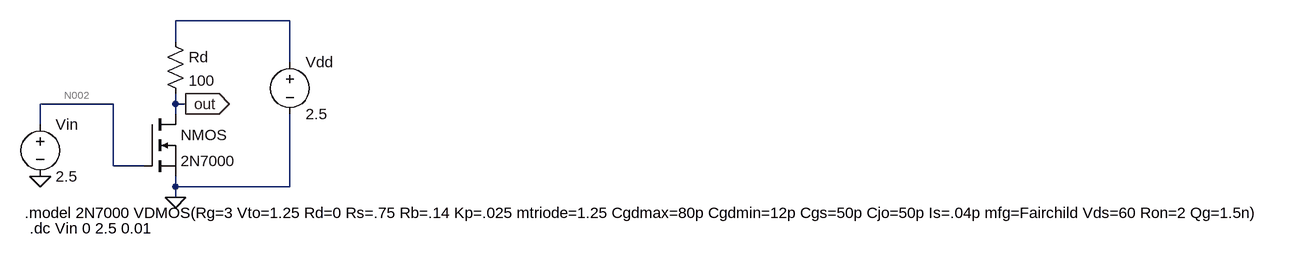
[diagram p0: schematic Draft3.asc]
Draft3.asc, the LTspice schematic file:
Version 4
SHEET 1 1360 680
WIRE 416 0 240 0
WIRE 240 32 240 0
WIRE 416 64 416 0
WIRE 144 128 32 128
WIRE 240 128 240 112
WIRE 256 128 240 128
WIRE 240 144 240 128
WIRE 32 160 32 128
WIRE 144 224 144 128
WIRE 192 224 144 224
WIRE 240 256 240 240
WIRE 416 256 416 144
WIRE 416 256 240 256
WIRE 240 272 240 256
FLAG 240 272 0
FLAG 32 240 0
FLAG 256 128 out
IOPIN 256 128 Out
SYMBOL nmos 192 144 R0
SYMATTR InstName NMOS
SYMATTR Value 2N7000
SYMBOL res 224 16 R0
SYMATTR InstName Rd
SYMATTR Value 100
SYMBOL voltage 416 48 R0
WINDOW 123 0 0 Left 0
WINDOW 39 0 0 Left 0
SYMATTR InstName Vdd
SYMATTR Value 2.5
SYMBOL voltage 32 144 R0
WINDOW 123 0 0 Left 0
WINDOW 39 0 0 Left 0
SYMATTR InstName Vin
SYMATTR Value 2.5
TEXT 8 296 Left 2 !.model 2N7000 VDMOS(Rg=3 Vto=1.25 Rd=0 Rs=.75 Rb=.14 Kp=.025 mtriode=1.25 Cgdmax=80p Cgdmin=12p Cgs=50p Cjo=50p Is=.04p mfg=Fairchild Vds=60 Ron=2 Qg=1.5n)
TEXT 16 320 Left 2 !.dc Vin 0 2.5 0.01

The netlist it stands for:
* Draft3.asc
M§NMOS out N002 0 0 2N7000
Rd N001 out 100
Vdd N001 0 2.5
Vin N002 0 2.5
.model NMOS NMOS
.model PMOS PMOS
.lib standard.mos
.model 2N7000 VDMOS(Rg=3 Vto=1.25 Rd=0 Rs=.75 Rb=.14 Kp=.025 mtriode=1.25 Cgdmax=80p Cgdmin=12p Cgs=50p Cjo=50p Is=.04p mfg=Fairchild Vds=60 Ron=2 Qg=1.5n)
.dc Vin 0 2.5 0.01
.backanno
.end

* Results of the author's LTspice run, read from the files saved beside the schematic
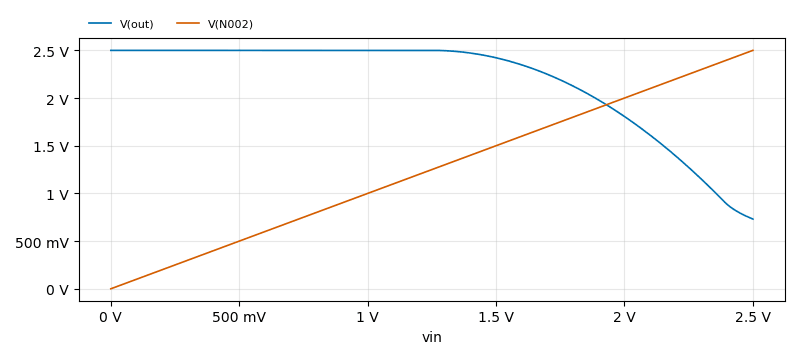
[diagram p1: DC transfer characteristic of Draft3.asc, plotted from the saved traces]
* DC transfer characteristic, 1 run:
*   V(out): 2.5 V at vin=0 V, 731.6 mV at vin=2.5 V, min 731.6 mV, max 2.5 V
*   V(N002): 0 V at vin=0 V, 2.5 V at vin=2.5 V, min 0 V, max 2.5 V